# EAGLE design DCF77_RX_1V0 (EAGLE 7.7.0)
UFBmod - the best digital modulation ever created :-)
Assembly variants: Std

## Sheet 1 of 4: Signal entry / n-FET
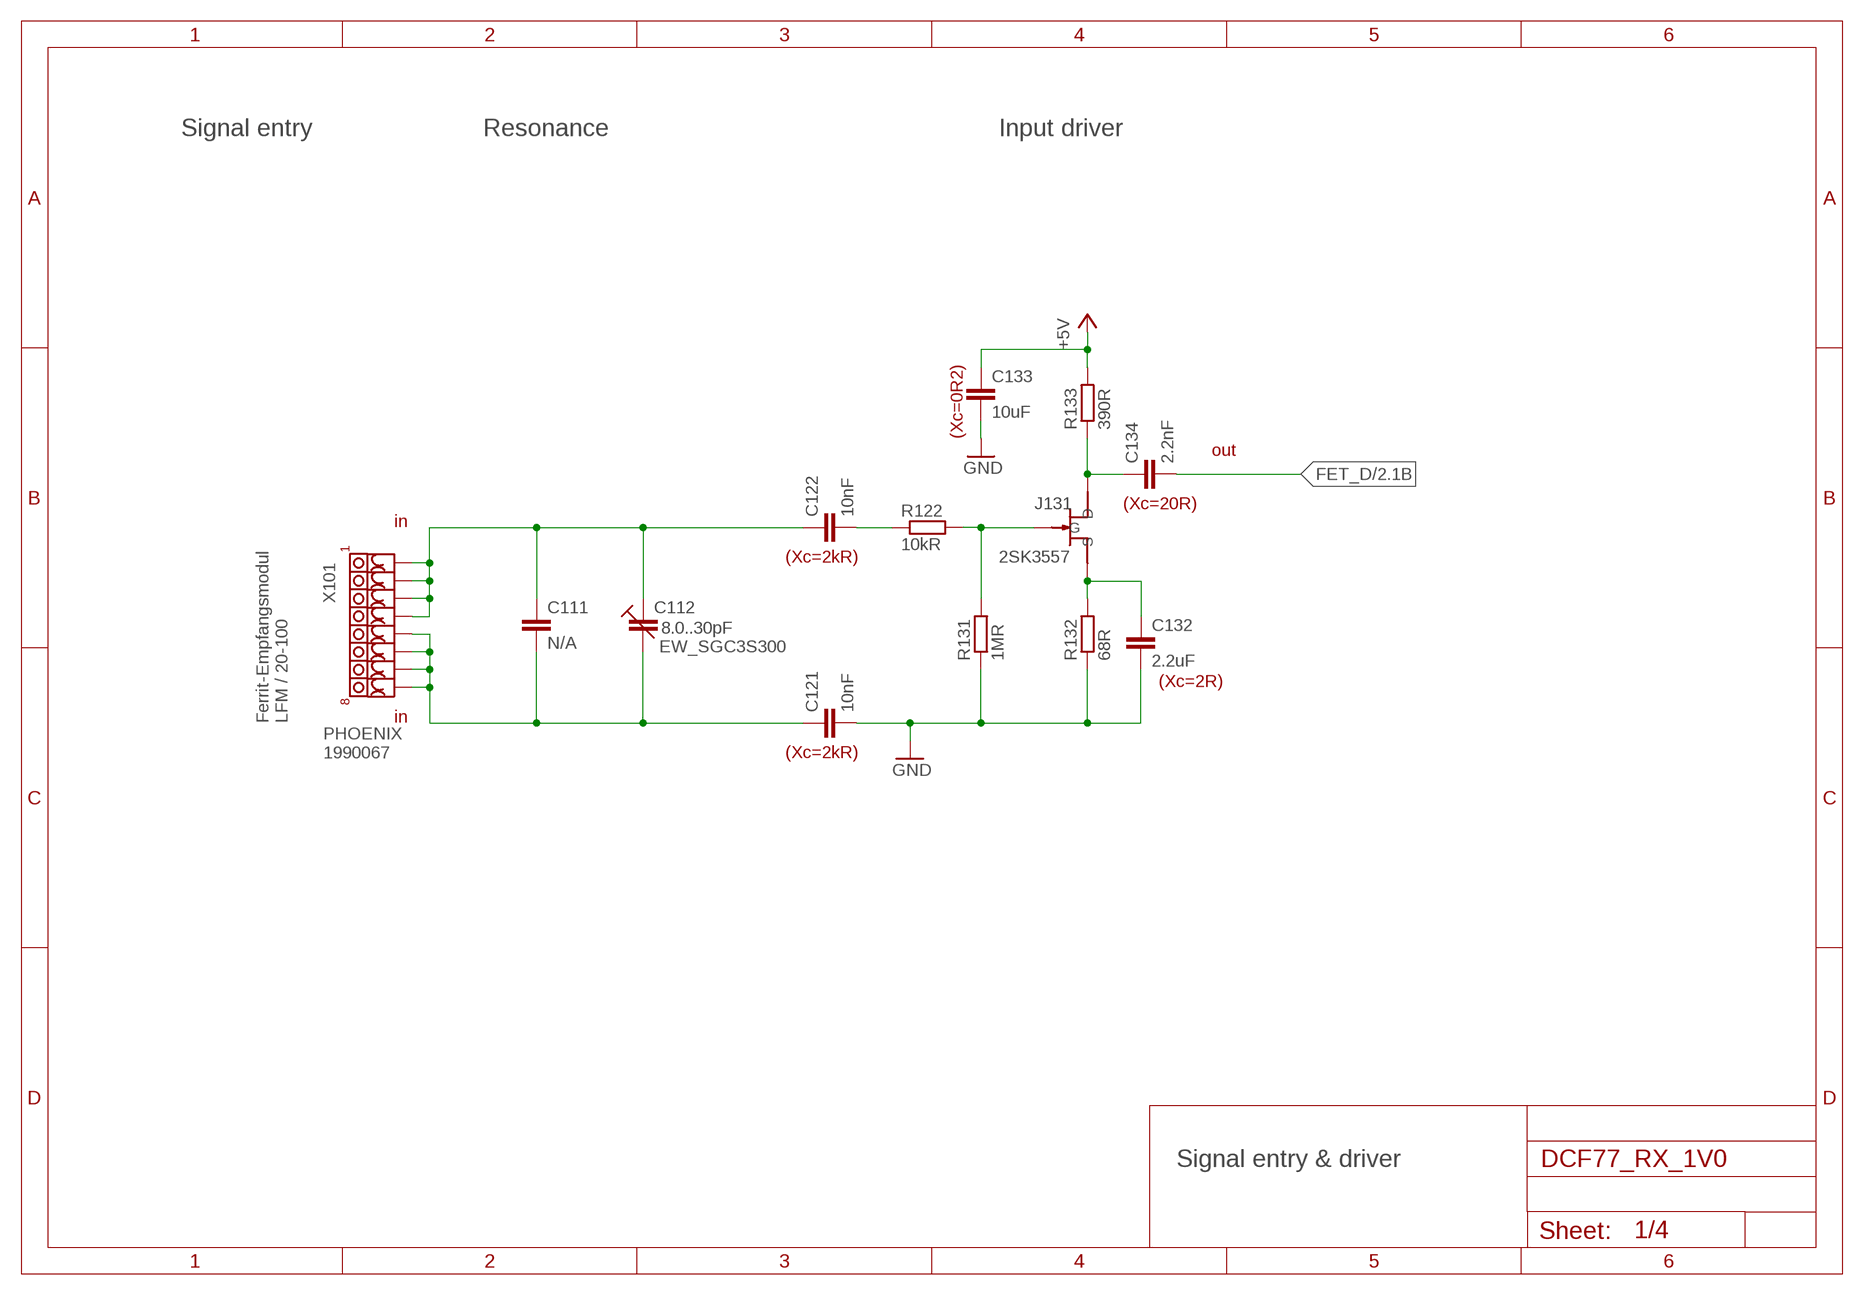
[diagram p0: schematic, sheet 1]

### Parts
C111  N/A  C-EUC0402  [C0402]
C112  EW_SGC3S300  C-TRIMM__EW_SGC3S  [4MM5_X_3MM2__EW_SGC3S]
C121  10nF  C-EUC0805  [C0805]
C122  10nF  C-EUC0805  [C0805]
C132  2.2uF  C-EUC0805  [C0805]
C133  10uF  C-EUC0805  [C0805]
C134  2.2nF  C-EUC0805  [C0805]
J131  2SK3557  2SK3557_N-JFET  [SOT23-3]
R122  10kR  R-EU_R0805  [R0805]
R131  1MR  R-EU_R0805  [R0805]
R132  68R  R-EU_R0805  [R0805]
R133  390R  R-EU_R0805  [R0805]
X101  PHOENIX_1990067_1X8X2MM50_PTSA-0-5  [PHOENIX_1990067_1X8X2MM50_PTSA-0-5]

### Nets
+5V: C133.1 R133.2 ; also sheet 2,3
FET_D: C134.2 ; also sheet 2
GND: C121.2 C132.2 C133.2 R131.1 R132.1 ; also sheet 2,3,4
N101: C111.2 C112.CSTAT C121.1 X101.5 X101.6 X101.7 X101.8
N102: C111.1 C112.CROT C122.1 X101.1 X101.2 X101.3 X101.4
N122: C122.2 R122.1
N131: J131.P$3(G) R122.2 R131.2
N132: C132.1 J131.P$1(S) R132.2
N133: C134.1 J131.P$2(D) R133.1

### Notes on the sheet
- Signal entry | Resonance | Input driver
- (Xc=0R2)
- out
- (Xc=20R)
- in
- (Xc=2kR)
- 8.0..30pF
- (Xc=2R)
- Ferrit-Empfangsmodul
  LFM / 20-100
- in
- PHOENIX 
  1990067
- (Xc=2kR)
- Signal entry & driver

## Sheet 2 of 4: Crystal & Amp
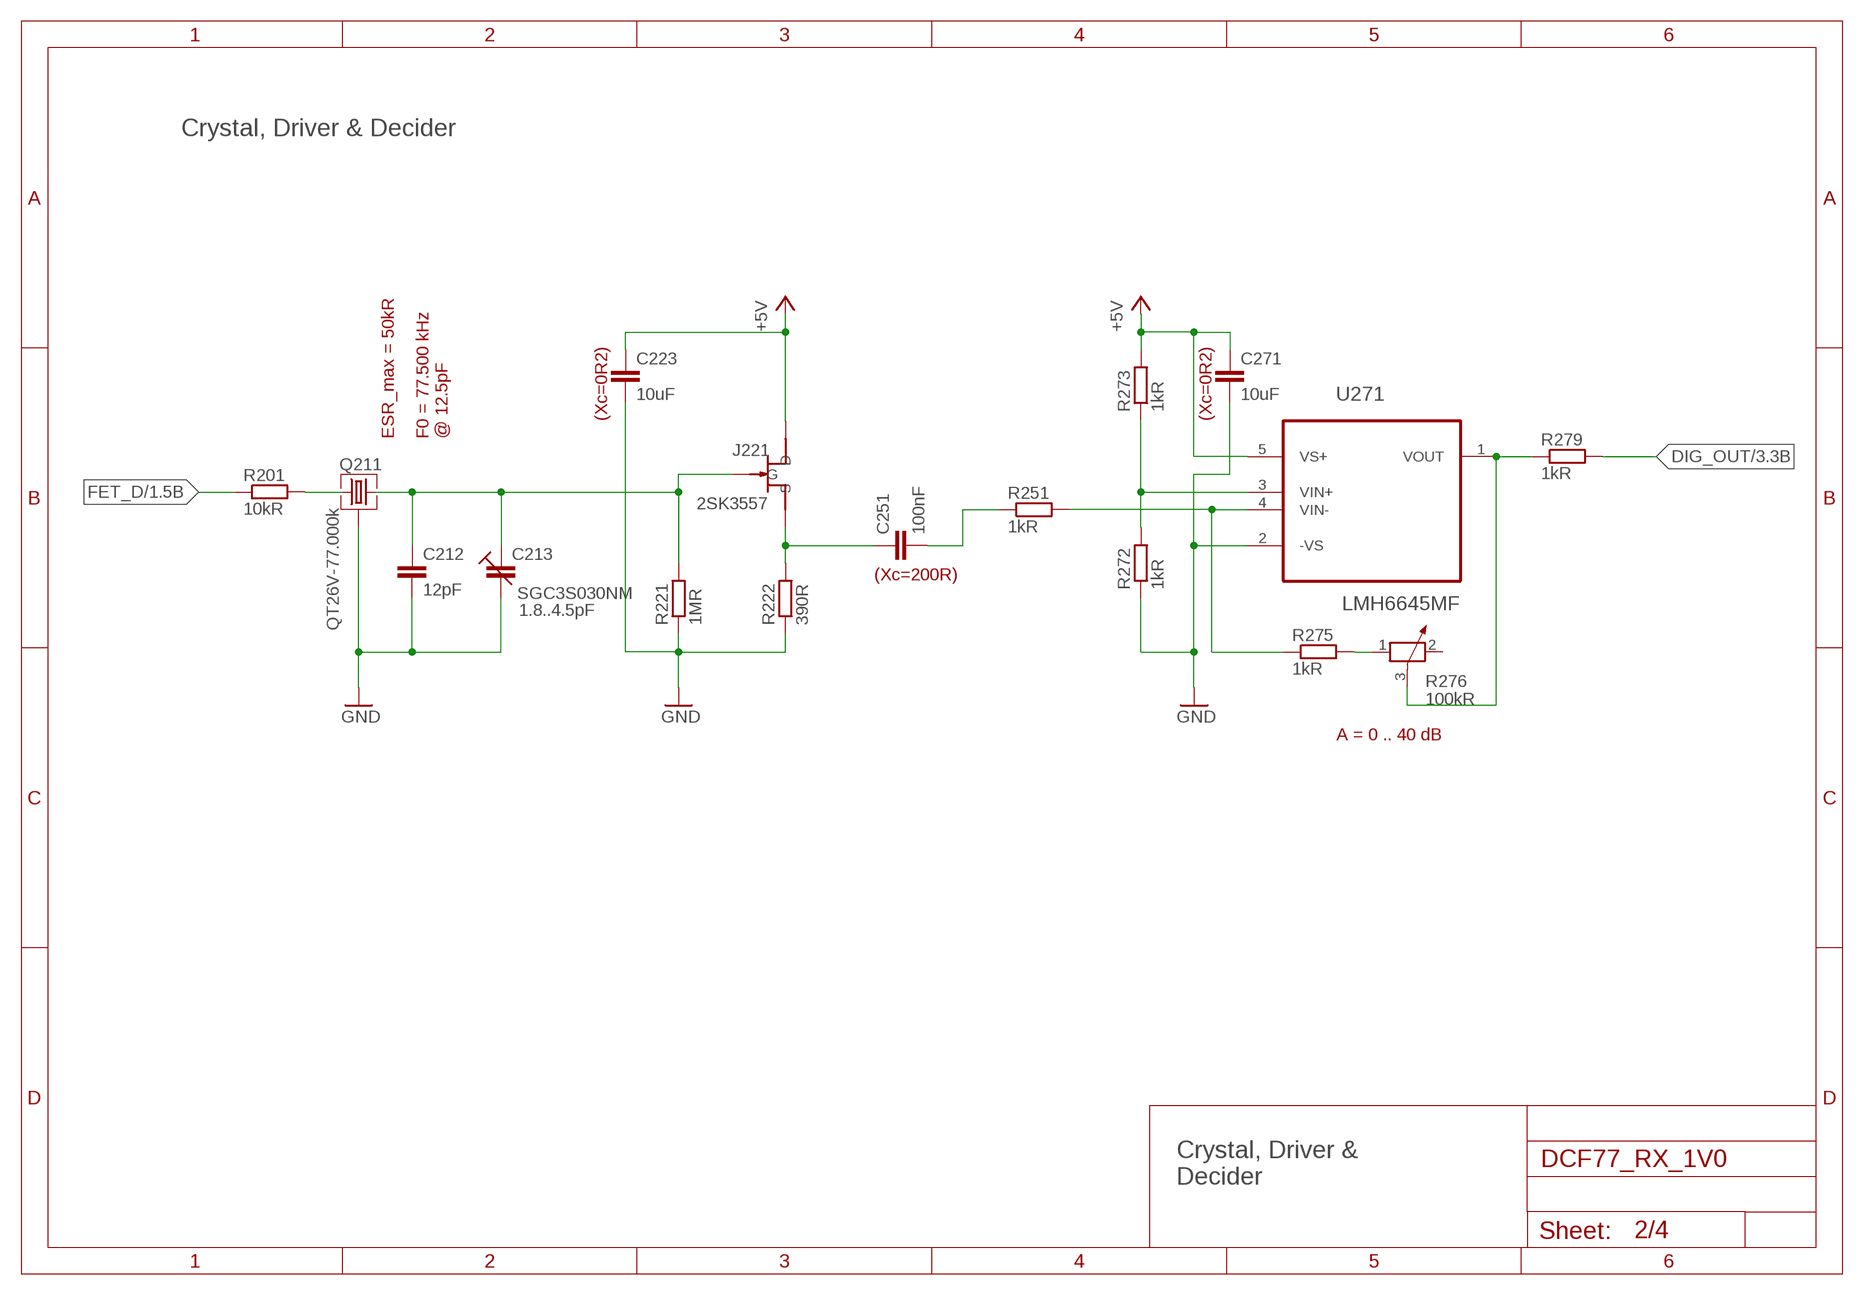
[diagram p1: schematic, sheet 2]

### Parts
C212  12pF  C-EUC0402  [C0402]
C213  SGC3S030NM  C-TRIMM__EW_SGC3S  [4MM5_X_3MM2__EW_SGC3S]
C223  10uF  C-EUC0805  [C0805]
C251  100nF  C-EUC0805  [C0805]
C271  10uF  C-EUC0805  [C0805]
J221  2SK3557  2SK3557_N-JFET  [SOT23-3]
Q211  QT26V-77.000k  QST_QT26V_77.5KHZ  [QT26V_QST]
R201  10kR  R-EU_R0805  [R0805]
R221  1MR  R-EU_R0805  [R0805]
R222  390R  R-EU_R0805  [R0805]
R251  1kR  R-EU_R0805  [R0805]
R272  1kR  R-EU_R0805  [R0805]
R273  1kR  R-EU_R0805  [R0805]
R275  1kR  R-EU_R0805  [R0805]
R276  100kR  POTENTIOMETER_PT-10  [PT-10]
R279  1kR  R-EU_R0805  [R0805]
U271  LMH6645MF  [SOT-23-5]

### Nets
+5V: C223.1 C271.1 J221.P$2(D) R273.2 U271.5(VS+) ; also sheet 1,3
DIG_OUT: R279.2 ; also sheet 3
FET_D: R201.1 ; also sheet 1
GND: C212.2 C213.CSTAT C223.2 C271.2 Q211.3 Q211.4 R221.1 R222.1 R272.1 U271.2(-VS) ; also sheet 1,3,4
N211: Q211.1 R201.2
N221: C212.1 C213.CROT J221.P$3(G) Q211.2 R221.2
N222: C251.1 J221.P$1(S) R222.2
N251: C251.2 R251.1
N271: R276.3 R279.1 U271.1(VOUT)
N272: R272.2 R273.1 U271.3(VIN+)
N273: R251.2 R275.1 U271.4(VIN-)
N275: R275.2 R276.1
Unconnected: R276.2

### Notes on the sheet
- Crystal, Driver & Decider
- (Xc=0R2) | (Xc=0R2)
- ESR_max = 50kR
- F0 = 77.500 kHz
  @ 12.5pF
- (Xc=200R)
- 1.8..4.5pF
- A = 0 .. 40 dB
- Crystal, Driver &
  Decider

## Sheet 3 of 4: Signal output
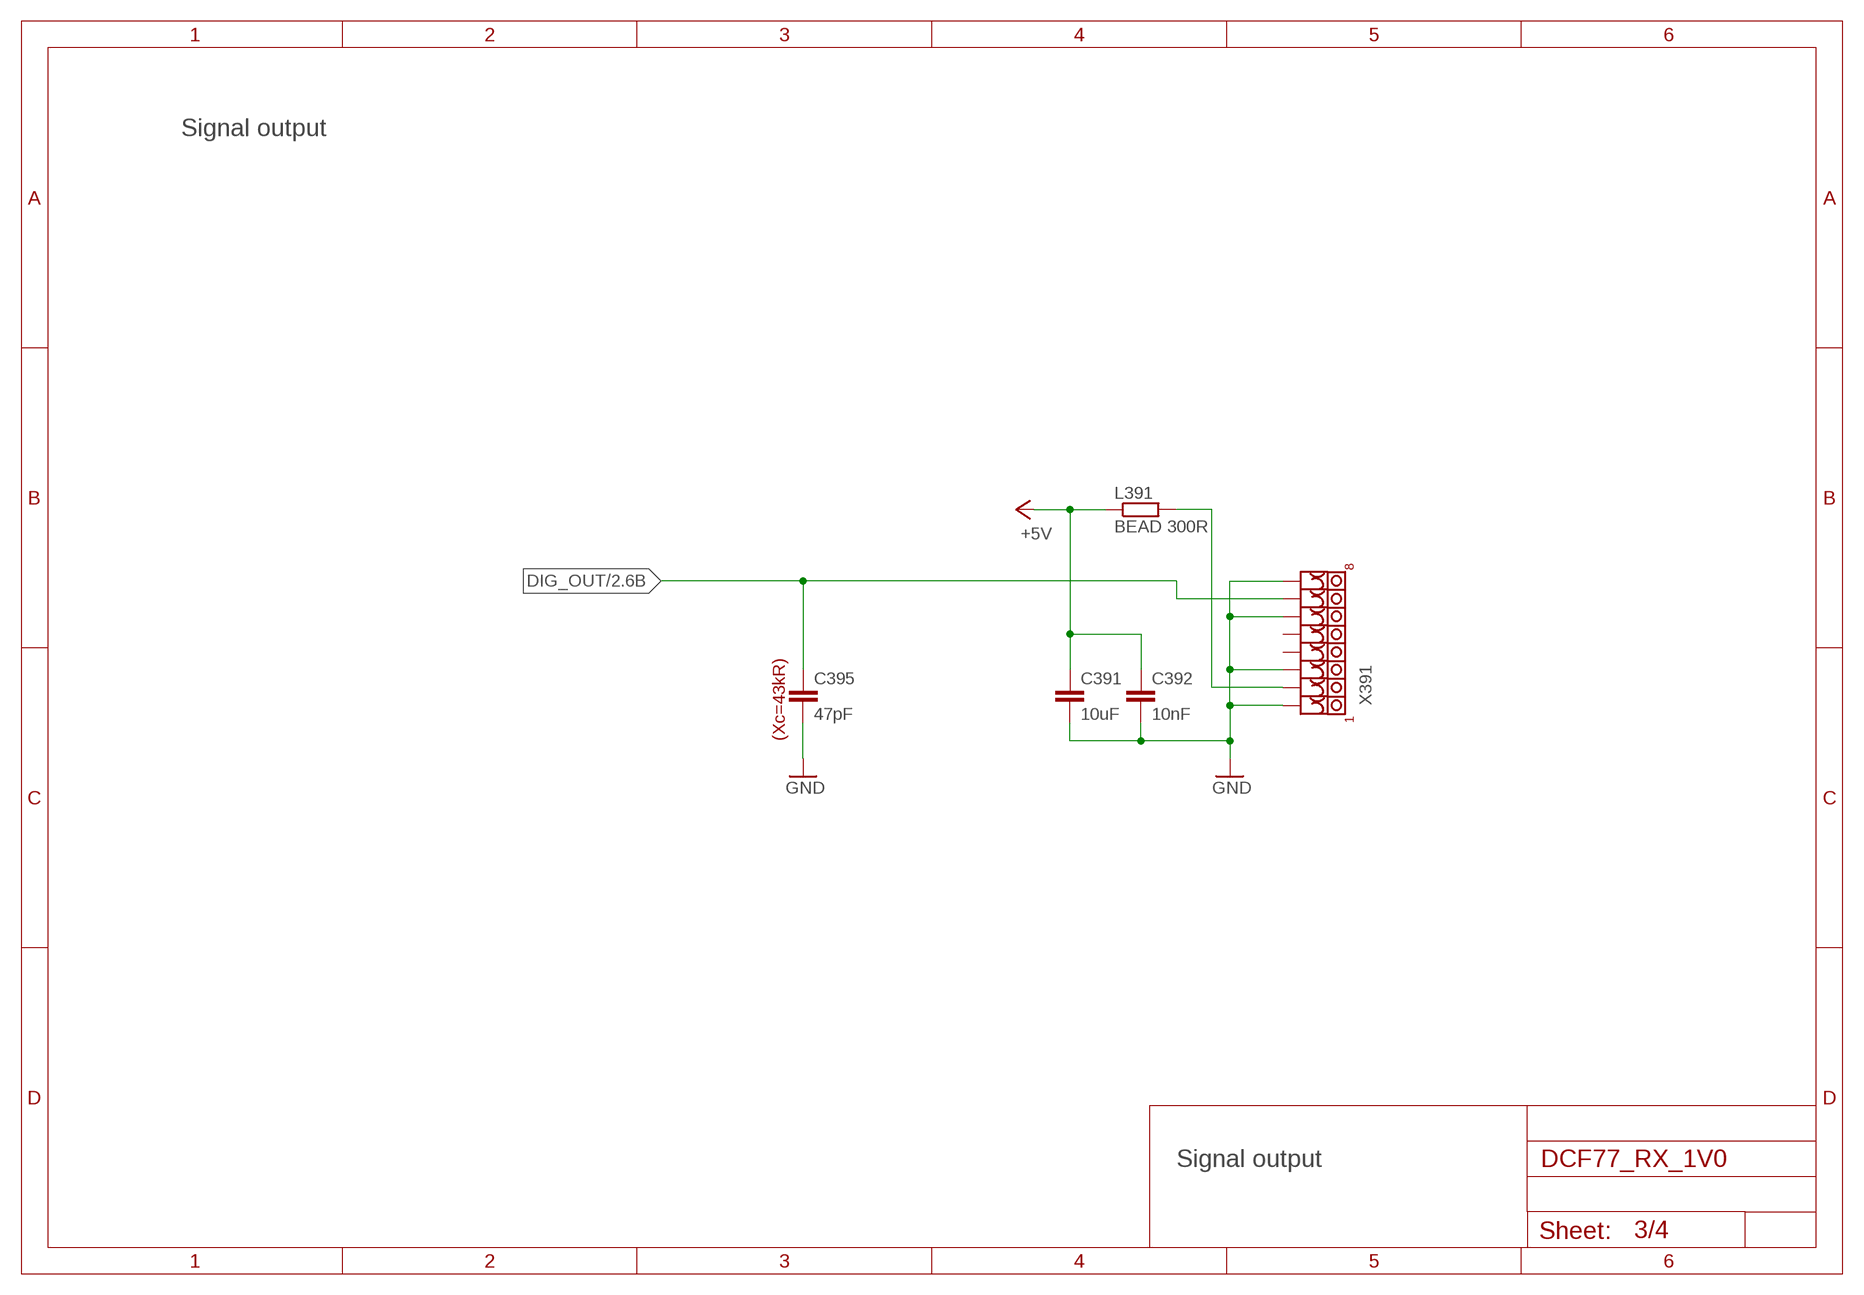
[diagram p2: schematic, sheet 3]

### Parts
C391  10uF  C-EUC0805  [C0805]
C392  10nF  C-EUC0805  [C0805]
C395  47pF  C-EUC0805  [C0805]
L391  BEAD 300R  R-EU_R1206  [R1206]
X391  PHOENIX_1990067_1X8X2MM50_PTSA-0-5  [PHOENIX_1990067_1X8X2MM50_PTSA-0-5]

### Nets
+5V: C391.1 C392.1 L391.1 ; also sheet 1,2
DIG_OUT: C395.1 X391.7 ; also sheet 2
GND: C391.2 C392.2 C395.2 X391.1 X391.3 X391.6 X391.8 ; also sheet 1,2,4
N391: L391.2 X391.2
Unconnected: X391.4 X391.5

### Notes on the sheet
- Signal output
- (Xc=43kR)
- Signal output

## Sheet 4 of 4: Mounting holes
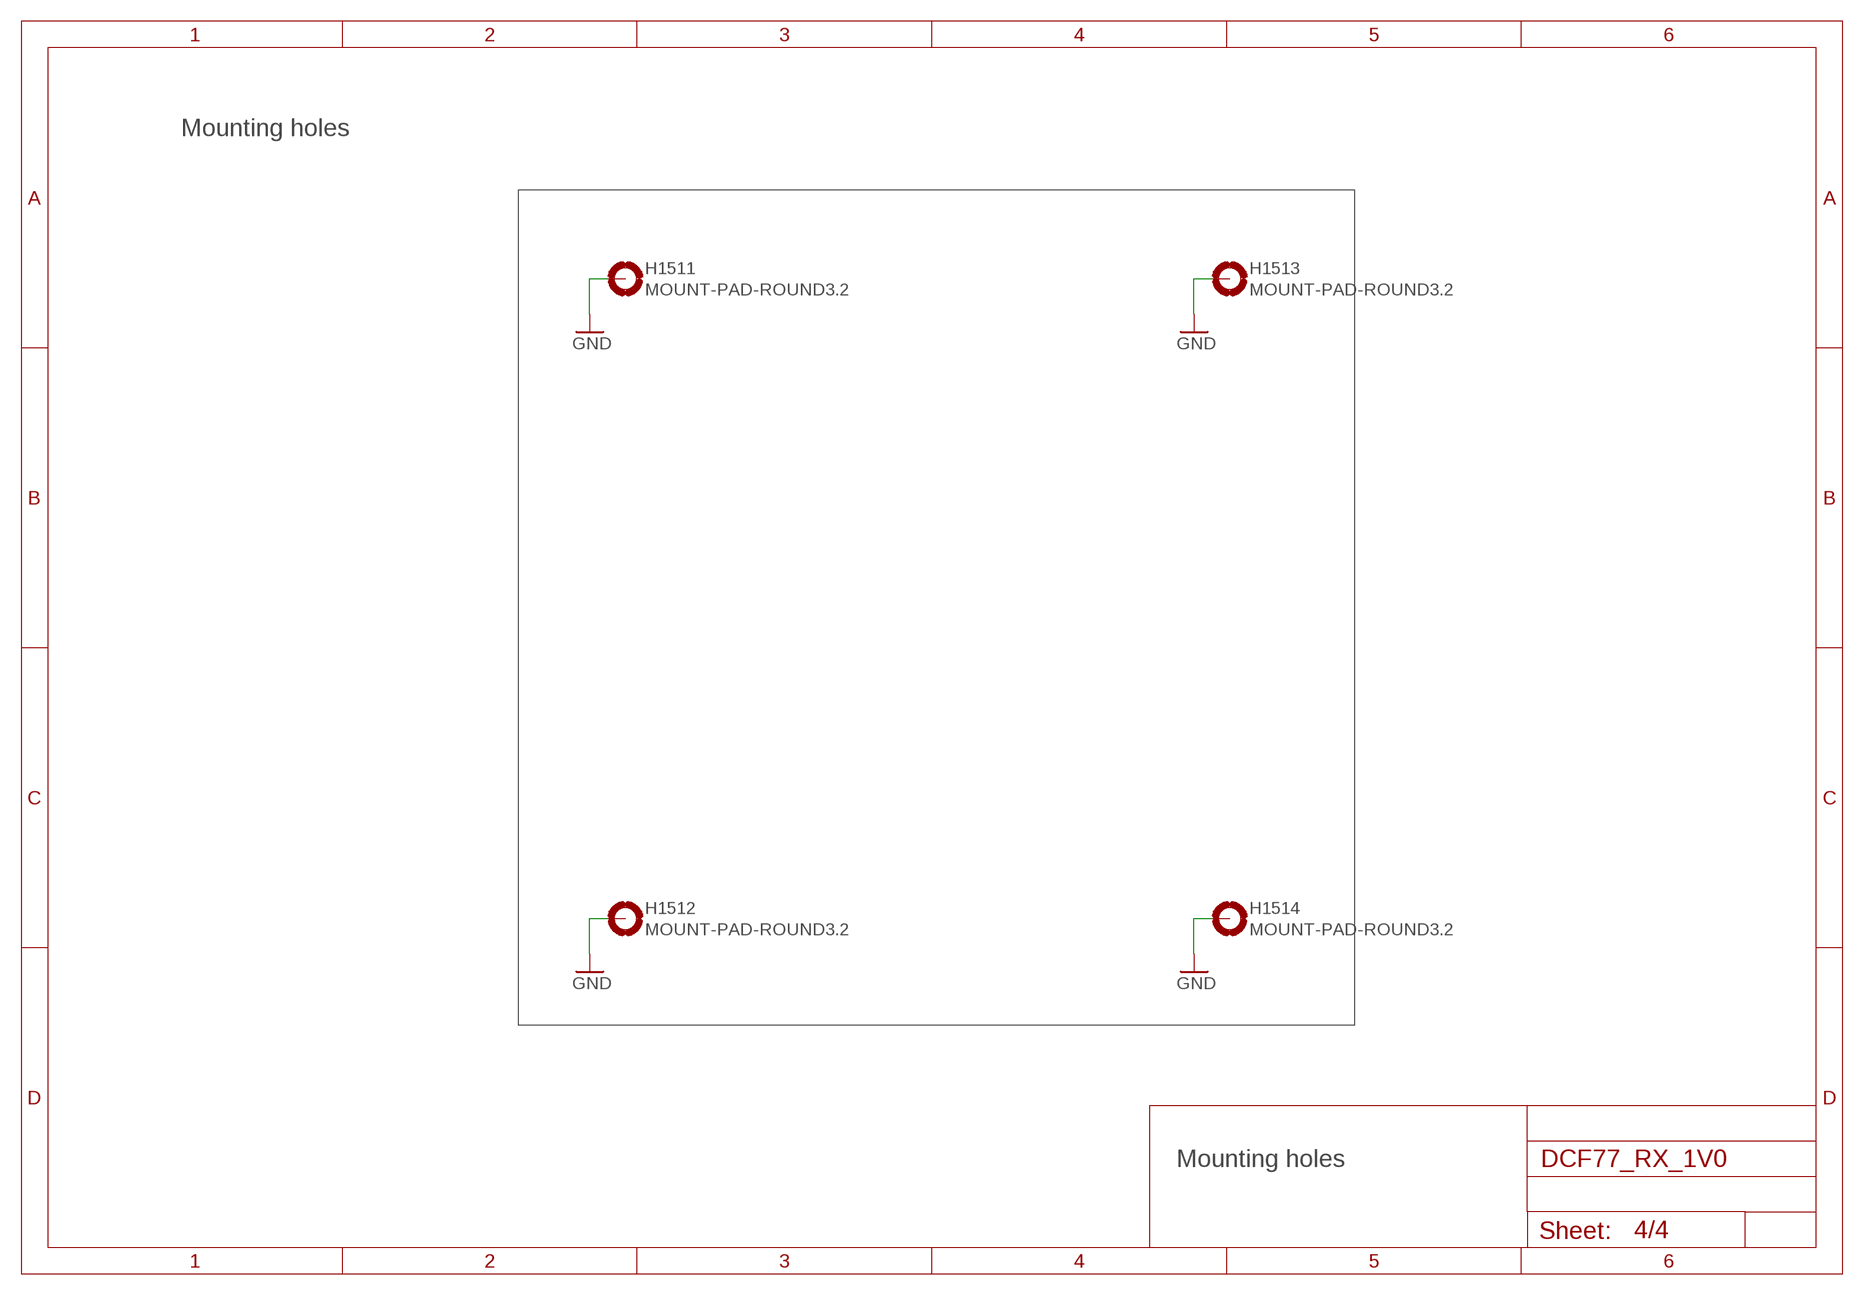
[diagram p3: schematic, sheet 4]

### Parts
H1511  MOUNT-PAD-ROUND3.2  [3,2-PAD]
H1512  MOUNT-PAD-ROUND3.2  [3,2-PAD]
H1513  MOUNT-PAD-ROUND3.2  [3,2-PAD]
H1514  MOUNT-PAD-ROUND3.2  [3,2-PAD]

### Nets
GND: H1511.B3,2(MOUNT) H1512.B3,2(MOUNT) H1513.B3,2(MOUNT) H1514.B3,2(MOUNT) ; also sheet 1,2,3

### Notes on the sheet
- Mounting holes
- Mounting holes

## Library data of the parts
C111 C121 C122 C132-C134 C212 C223 C251 C271 C391 C392 C395 = df4iah_rcl:C-EU: CAPACITOR, European symbol
C112 C213 = df4iah_c-trimm:C-TRIMM__EW_SGC3S: Trimm capacitor SMD - EW SGC3S 4.5 mm x 3.2 mm
H1511-H1514 = df4iah_holes:MOUNT-PAD-ROUND: MOUNTING PAD, round
J131 J221 = df4iah_jfet:2SK3557_N-JFET: 2SK3557 n-channel JFET
L391 R122 R131-R133 R201 R221 R222 R251 R272 R273 R275 R279 = df4iah_rcl:R-EU_: RESISTOR, European symbol
Q211 = df4iah_crystal:QST_QT26V_77.5KHZ: Crystal - QST QT26V 77.500 kHz
R276 = df4iah_rcl:POTENTIOMETER_: Potentiometer
U271 = df4iah_opamp:LMH6645MF: Wideband, Fixed Gain, JFET-Input AMPLIFIER; OC_FARNELL: 1312813; OC_NEWARK: -; PACKAGE: SOT-23-5; SUPPLIER: Texas Instruments
X101 X391 = df4iah_connector:PHOENIX_1990067_1X8X2MM50_PTSA-0-5: PCB terminal block - PTSA 0,5/8-2,5-Z - 1990067 PCB terminal block, nominal current: 2 A, nom. voltage: 250 V, pitch: 2.5 mm, number of positions: 8, connection method: Push-in spring connection, mounting: Wave soldering, conductor/PCB connection direction: 45 °

## Net classes
0 default: width 0.127 mm, drill 0.3 mm, clearance 0.127 mm
1 diff_100R_200u: width 0.203 mm, drill 0.3 mm, clearance 0.203 mm
2 diff_100R_280u: width 0.229 mm, drill 0.3 mm, clearance 0.152 mm
3 diff_100R_360u: width 0.267 mm, drill 0.3 mm, clearance 0.152 mm
4 diff_90R_200u: width 0.216 mm, drill 0.3 mm, clearance 0.152 mm
5 diff_90R_280u: width 0.292 mm, drill 0.3 mm, clearance 0.152 mm
6 diff_90R_360u: width 0.318 mm, drill 0.3 mm, clearance 0.127 mm
7 uni_50R_200u: width 0.343 mm, drill 0.3 mm, clearance 0.381 mm
8 uni_50R_280u: width 0.483 mm, drill 0.3 mm, clearance 0.381 mm
9 uni_50R_360u: width 0.635 mm, drill 0.3 mm, clearance 0.381 mm
10 diff_50R_200u: width 0.508 mm, drill 0.3 mm, clearance 0.127 mm

## Board
DCF77_RX receiver board for the timing and time normal of Europe.
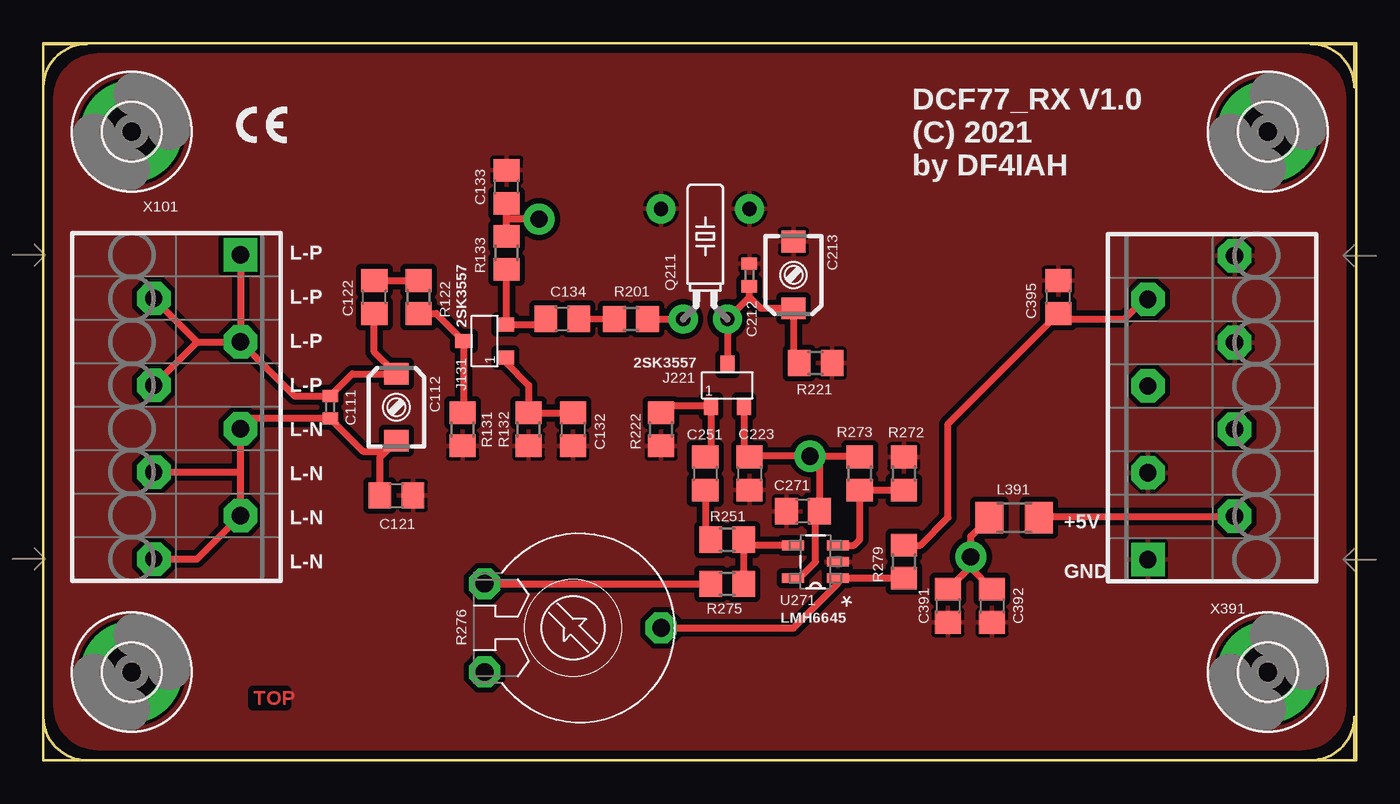
[diagram p4: board, top side]
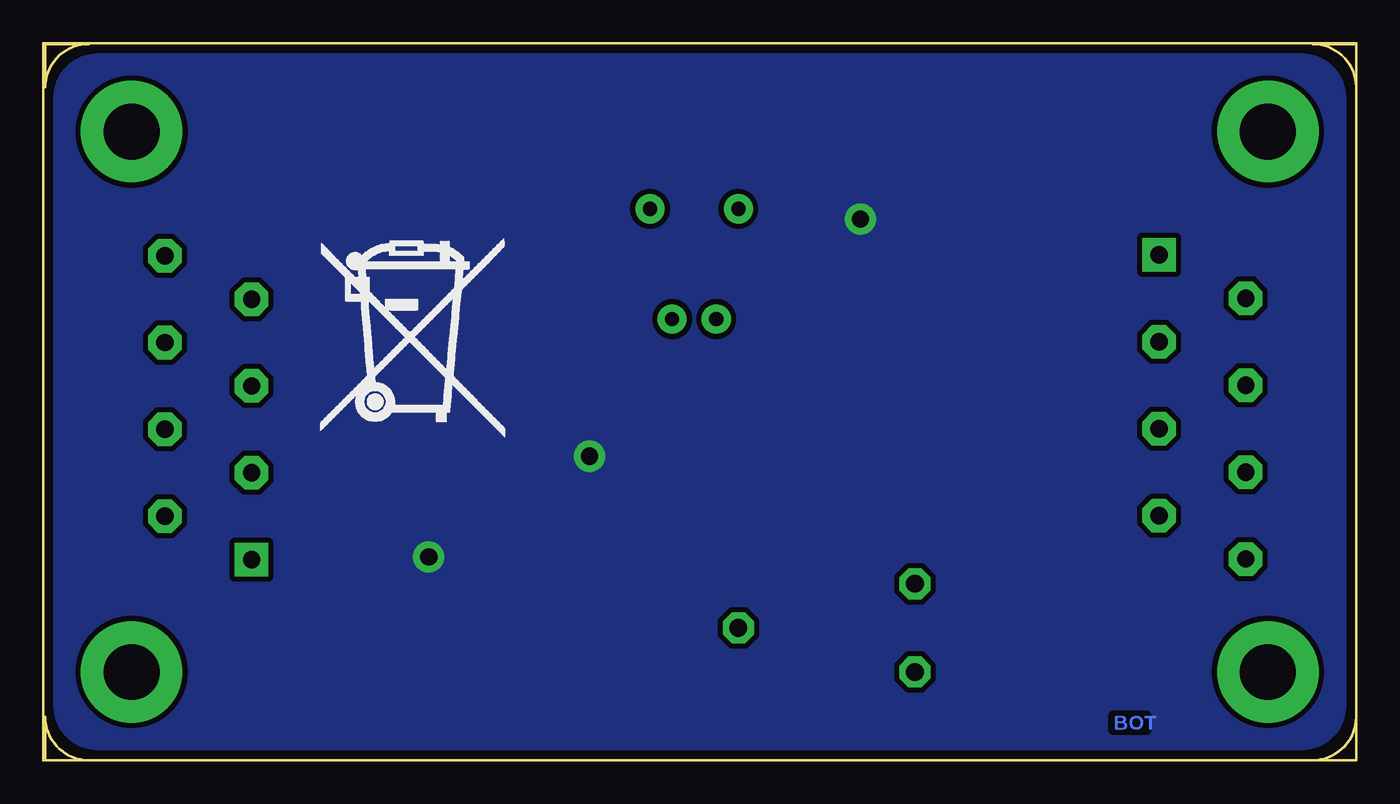
[diagram p5: board, bottom side, seen from below]

Size 75.56 x 41.27 mm. Coordinates in mm from the lower left corner, seen from the top.
Outline: 0,0 0,41.27 75.56,41.27 75.56,0 0,0
Copper layers (1*16): Top__SigA_Pair 0.035mm / dielectric 0.2mm / Bottom__SigB_Pair 0.035mm
Design rules "PCB-POOL Standard_ML6 *": minimum track width 0.15mm, minimum drill 0.3mm, track to track 0.15mm, track to pad 0.15mm, pad to pad 0.15mm, via to via 0.15mm, smd to smd 0.15mm, copper to edge 0.3mm, drill to drill 0.2mm, minimum pad ring 0.2mm, minimum via ring 0.15mm, stop-mask expansion 0.075mm, vias tented up to drill 0mil, thermal gap 0.2mm
Milling: area 0,38.7 to 2.5,41.2; area 0,0 to 2.5,2.5; area 73,0 to 75.5,2.5; area 73,38.7 to 75.5,41.2

### Footprints (pad centres in the part's own frame; a part is rotated, then mirrored left to right if it is on the bottom)
C0402 = smd 0.7 x 0.9: 1 -0.65,0; 2 0.65,0
4MM5_X_3MM2__EW_SGC3S = smd 1.4 x 1.25: CROT 0,1.925; CSTAT 0,-1.925
C0805 = smd 1.3 x 1.5: 1 -0.95,0; 2 0.95,0
3,2-PAD = drill 3.2 pad 5.842: B3,2 0,0
SOT23-3 = smd 0.8 x 1: P$1 -0.95,-1.2; P$2 0.95,-1.2; P$3 0,1.2
R1206 = smd 1.6 x 1.803: 1 -1.422,0; 2 1.422,0
QT26V_QST = drill 0.813 pad 1.676: 1 -1.27,0; 2 1.27,0; 3 -2.54,6.35; 4 2.54,6.35
R0805 = smd 1.3 x 1.5: 1 -0.95,0; 2 0.95,0
PT-10 = drill 1.016 pad 1.778 octagon: 1 -2.54,-5.08; 2 2.54,-5.08; 3 0,5.08
SOT-23-5 = smd 1.27 x 0.559: 1 -1.295,0.94; 2 -1.295,0; 3 -1.295,-0.94; 4 1.295,-0.94; 5 1.295,0.94
PHOENIX_1990067_1X8X2MM50_PTSA-0-5 = drill 1 pad 1.93 square: 1 -7.5,5 | drill 1 pad 1.93 octagon: 2 -5,0; 3 -2.5,5; 4 0,0; 5 2.5,5; 6 5,0; 7 7.5,5; 8 10,0

### Placement (x,y rotation side)
C111  16.51,20.32 270 top
C112  20.32,20.32 0 top
C121  20.32,15.24 0 top
C122  19.05,26.67 90 top
C132  30.48,19.05 270 top
C133  26.67,33.02 90 top
C134  29.86,25.42 0 top
C212  40.64,27.94 90 top
C213  43.18,27.94 180 top
C223  40.64,16.51 270 top
C251  38.1,16.51 270 top
C271  43.72,14.34 180 top
C391  52.07,8.89 270 top
C392  54.61,8.89 270 top
C395  58.42,26.67 90 top
H1511  5.08,36.2 0 top
H1512  5.08,5.08 0 top
H1513  70.48,36.2 0 top
H1514  70.48,5.08 0 top
J131  25.4,24.13 90 top
J221  39.37,21.59 0 top
L391  55.88,13.97 0 top
Q211  38.1,25.4 0 top
R122  21.59,26.67 270 top
R131  24.13,19.05 90 top
R132  27.94,19.05 90 top
R133  26.67,29.21 90 top
R201  33.82,25.4 0 top
R221  44.45,22.86 180 top
R222  35.56,19.05 90 top
R251  39.37,12.7 0 top
R272  49.53,16.51 270 top
R273  46.99,16.51 90 top
R275  39.37,10.16 180 top
R276  30.48,7.62 270 top
R279  49.53,11.43 90 top
U271  44.45,11.43 180 top
X101  6.35,21.59 270 top
X391  68.58,19.05 90 top

### Tracks (layer width: path | path; a pad name or v marks a point on that pad's centre or on a via)
+5V  (via drill 1)
  Top__SigA_Pair 0.406: R133.2 26.67,31.16 | v28.53,31.16 26.67,31.16 | 26.67,31.16 C133.1 | v44.13,17.51 40.69,17.51 C223.1 40.32,17.78 J221.P$2 | v53.39,11.71 53.39,12.9 L391.1 | v53.39,11.71 53.39,11.06 C392.1 | C391.1 53.39,11.16 v53.39,11.71 | v44.13,17.51 46.94,17.51 R273.2 | v44.13,17.51 44.67,16.96 C271.1 44.45,14.12 44.45,11.43 43.51,10.49 U271.5
  pour Bottom__SigB_Pair (isolate 0.305): 72.43,0.64 3.13,0.64 arc-90 0.64,3.13 0.64,38.14 arc-90 3.13,40.64 72.43,40.64 arc-90 74.93,38.14 74.93,3.13 arc-90
DIG_OUT
  Top__SigA_Pair 0.406: X391.7 63.38,26.55 62.23,25.4 58.74,25.4 C395.1 52.07,19.37 52.07,13.97 50.48,12.38 R279.2
FET_D
  Top__SigA_Pair 0.406: C134.2 R201.1
GND
  pour Top__SigA_Pair (isolate 0.305, rank 3): 72.43,0.64 3.13,0.64 arc-90 0.64,3.13 0.64,38.14 arc-90 3.13,40.64 72.43,40.64 arc-90 74.93,38.14 74.93,3.13 arc-90
N101
  Top__SigA_Pair 0.406: 11.35,16.51 X101.7 8.85,11.59 X101.8 | 11.35,16.51 X101.5 11.93,19.67 C111.2 18.4,17.78 19.7,17.78 C112.CSTAT 19.37,17.45 C121.1 | X101.6 11.27,16.59 11.35,16.51
N102
  Top__SigA_Pair 0.406: C122.1 19.05,23.52 C112.CROT 17.79,22.25 C111.1 14.47,20.97 X101.3 | X101.1 X101.3 | X101.2 8.85,24.09 | X101.4 8.85,24.09 | 8.85,24.09 X101.3
N122
  Top__SigA_Pair 0.406: C122.2 R122.1
N131
  Top__SigA_Pair 0.406: R122.2 22.61,25.72 J131.P$3 24.2,20.07 R131.2
N132
  Top__SigA_Pair 0.406: J131.P$1 26.6,22.93 27.94,21.59 R132.2 C132.1
N133
  Top__SigA_Pair 0.406: R133.1 26.67,25.08 J131.P$2 29.21,25.08 C134.1
N211
  Top__SigA_Pair 0.406: R201.2 Q211.1
N221
  Top__SigA_Pair 0.406: R221.2 43.18,23.18 C213.CROT 41.3,26.02 40.64,26.67 | J221.P$3 Q211.2 40.64,26.67 | 40.64,26.67 C212.1
N222
  Top__SigA_Pair 0.406: R222.2 35.95,20.39 J221.P$1 38.42,17.78 C251.1
N251
  Top__SigA_Pair 0.406: C251.2 38.1,13.02 R251.1
N271
  Top__SigA_Pair 0.406: R276.3 43.18,7.62 45.72,10.16 45.72,10.46 U271.1 R279.1
N272
  Top__SigA_Pair 0.406: U271.3 46.66,12.37 46.99,12.7 R273.1 R272.2
N273
  Top__SigA_Pair 0.406: U271.4 40.65,12.37 R251.2 R275.1
N275
  Top__SigA_Pair 0.406: R276.1 R275.2
N391
  Top__SigA_Pair 0.406: L391.2 57.38,14.05 X391.2

### Text on the board
Top__SigA_Pair: TOP
Bottom__SigB_Pair: BOT
tPlace: DCF77_RX V1.0 / (C) 2021 / by DF4IAH | L-P | L-P | L-P | L-P | L-N | L-N | L-N | +5V | L-N | GND
tNames: 2SK3557 | 2SK3557 | LMH6645